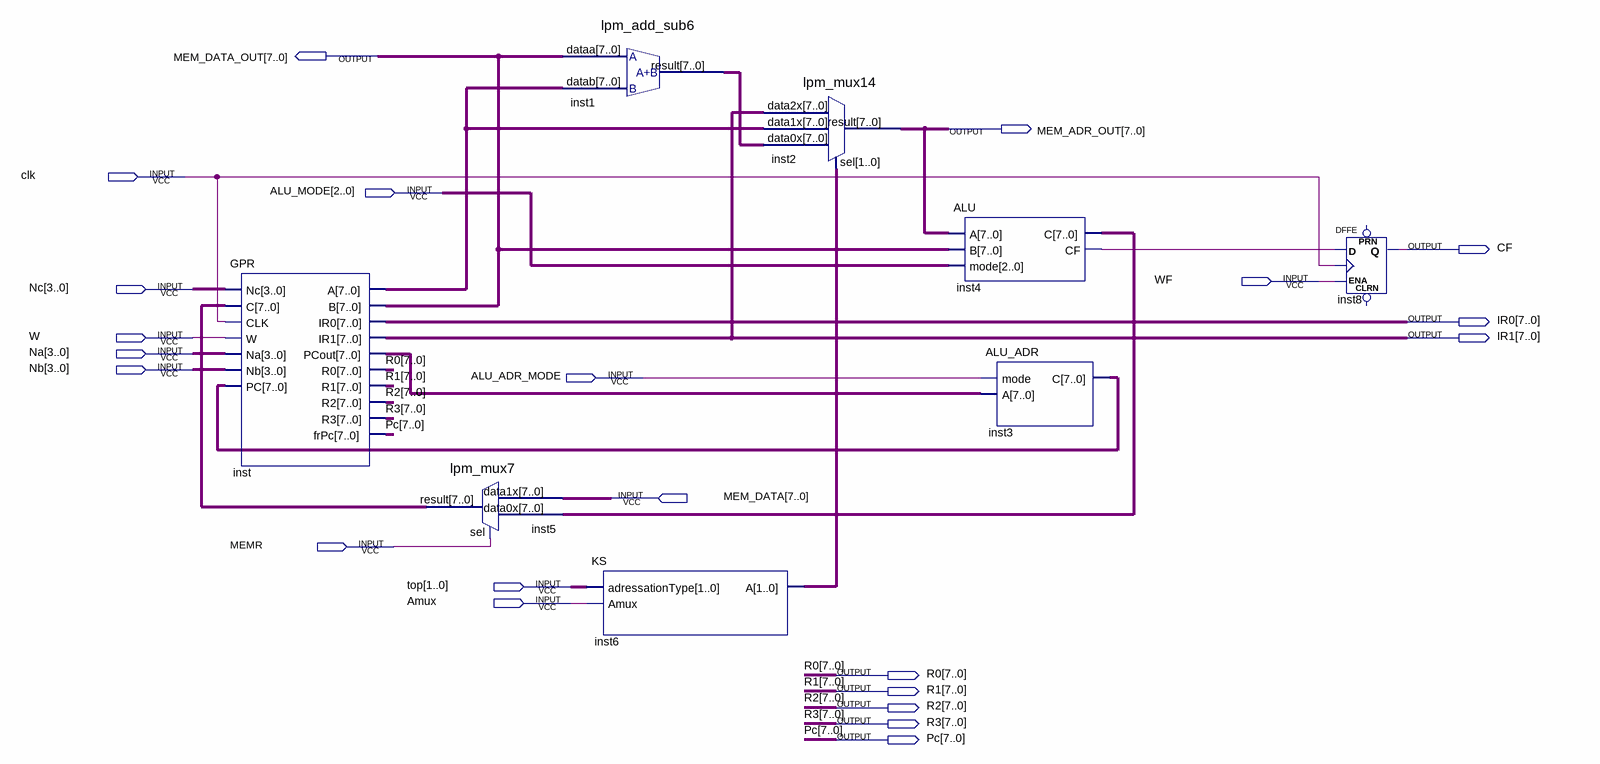
[diagram p0: schematic sheet]
// Quartus schematic OperationD.bdf as structural Verilog: 8 symbols, 22 pins
module OperationD (
  input  clk,
  input  [2:0] ALU_MODE,
  input  WF,
  input  [3:0] Nc,
  input  W,
  input  [3:0] Na,
  input  [3:0] Nb,
  input  ALU_ADR_MODE,
  input  [7:0] MEM_DATA,
  input  MEMR,
  input  [1:0] top,
  input  Amux,
  output [7:0] MEM_DATA_OUT,
  output [7:0] MEM_ADR_OUT,
  output CF,
  output [7:0] IR0,
  output [7:0] IR1,
  output [7:0] R0,
  output [7:0] R1,
  output [7:0] R2,
  output [7:0] R3,
  output [7:0] Pc
);

  wire inst4_cf;
  wire [1:0] inst6_a;
  wire [7:0] inst1_result, inst3_c, inst4_c, inst5_result, inst_a, inst_pcout;

  GPR inst (
    .Nc(Nc), .C(inst5_result), .CLK(clk), .W(W), .Na(Na), .Nb(Nb), .PC(inst3_c), .A(inst_a),
    .B(MEM_DATA_OUT), .IR0(IR0), .IR1(IR1), .PCout(inst_pcout), .R0(R0), .R1(R1), .R2(R2), .R3(R3), .frPc(Pc));
  lpm_mux7 inst5 (.data1x(MEM_DATA), .data0x(inst4_c), .sel(MEMR), .result(inst5_result));
  lpm_add_sub6 inst1 (.dataa(MEM_DATA_OUT), .datab(inst_a), .result(inst1_result));
  KS inst6 (.adressationType(top), .Amux(Amux), .A(inst6_a));
  lpm_mux14 inst2 (.data2x(IR1), .data1x(inst_a), .data0x(inst1_result), .sel(inst6_a), .result(MEM_ADR_OUT));
  ALU inst4 (.A(MEM_ADR_OUT), .B(MEM_DATA_OUT), .mode(ALU_MODE), .C(inst4_c), .CF(inst4_cf));
  ALU_ADR inst3 (.mode(ALU_ADR_MODE), .A(inst_pcout), .C(inst3_c));
  DFFE inst8 (.D(inst4_cf), .CLK(clk), .ENA(WF), .Q(CF));  // open: PRN, CLRN
endmodule
